# EAGLE design PCB (EAGLE 8.3.2)
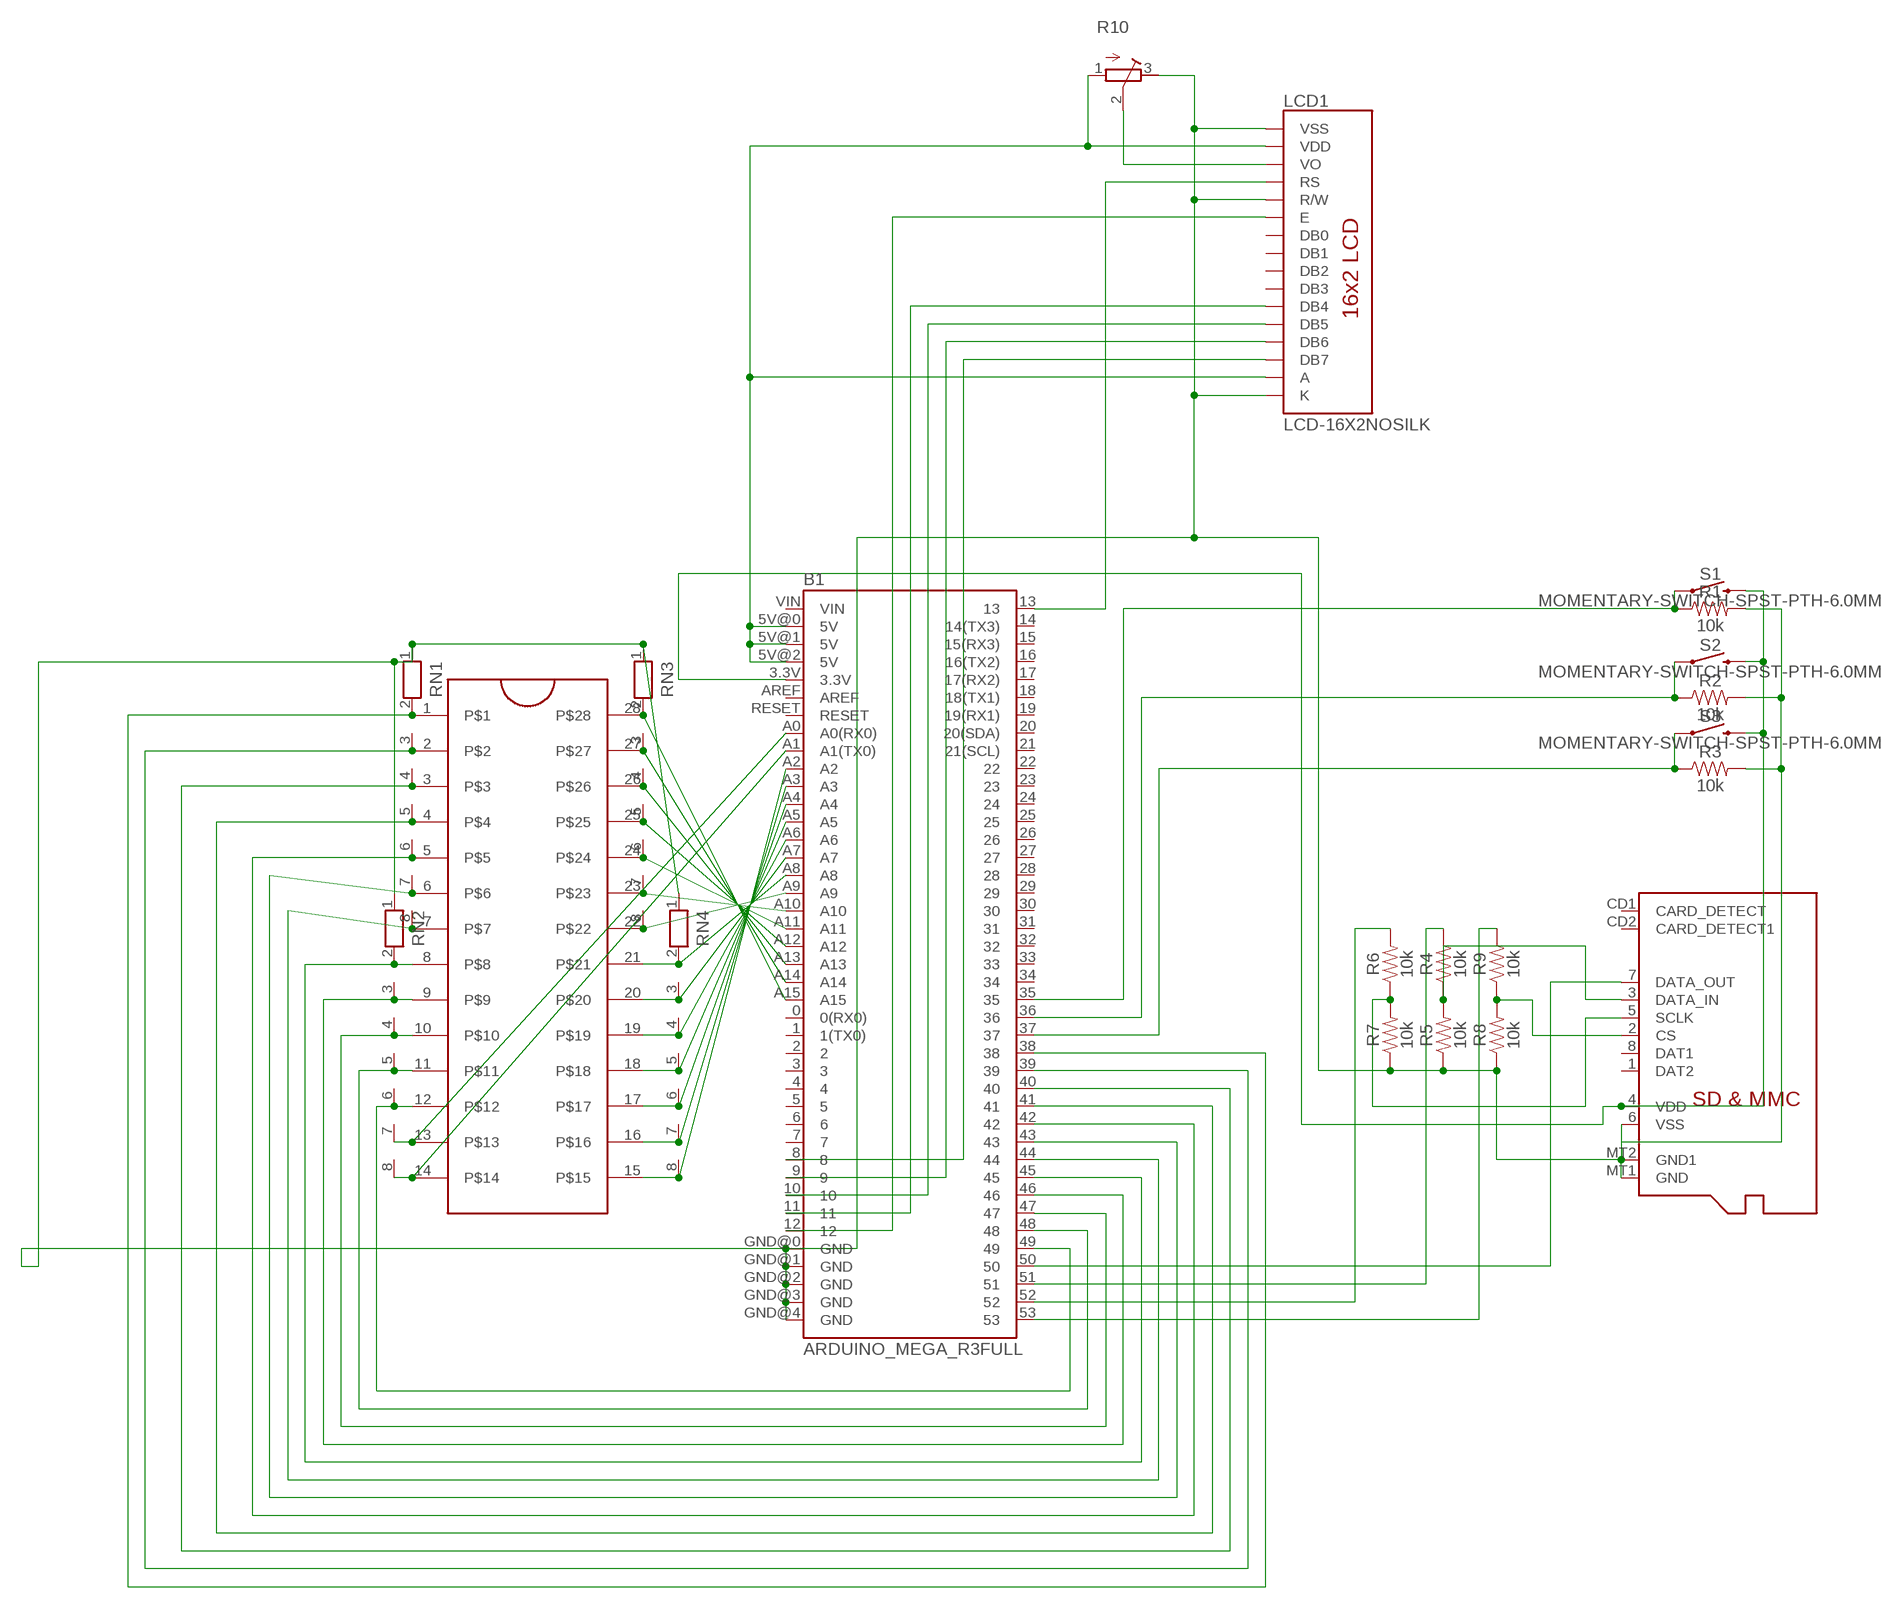
[diagram p0: schematic, sheet 1]

## Parts
B1  ARDUINO_MEGA_R3FULL  [ARDUINO_MEGA]
LCD1  LCD-16X2NOSILK  [LCD-16X2_NOSILK]
R1  10k  10KOHM-HORIZ-1/4W-5%  [AXIAL-0.3]
R2  10k  10KOHM-HORIZ-1/4W-5%  [AXIAL-0.3]
R3  10k  10KOHM-HORIZ-1/4W-5%  [AXIAL-0.3]
R4  10k  10KOHM-HORIZ-1/4W-5%  [AXIAL-0.3]
R5  10k  10KOHM-HORIZ-1/4W-5%  [AXIAL-0.3]
R6  10k  10KOHM-HORIZ-1/4W-5%  [AXIAL-0.3]
R7  10k  10KOHM-HORIZ-1/4W-5%  [AXIAL-0.3]
R8  10k  10KOHM-HORIZ-1/4W-5%  [AXIAL-0.3]
R9  10k  10KOHM-HORIZ-1/4W-5%  [AXIAL-0.3]
R10  R-TRIMM3339P  [RTRIM3339P]
RN1  RN07  [RN-8]
RN2  RN07  [RN-8]
RN3  RN07  [RN-8]
RN4  RN07  [RN-8]
S1  MOMENTARY-SWITCH-SPST-PTH-6.0MM  [TACTILE_SWITCH_PTH_6.0MM]
S2  MOMENTARY-SWITCH-SPST-PTH-6.0MM  [TACTILE_SWITCH_PTH_6.0MM]
S3  MOMENTARY-SWITCH-SPST-PTH-6.0MM  [TACTILE_SWITCH_PTH_6.0MM]
U$1  MICROSD  [MICROSD]
U$2  ZIFSOCKET-28-3ZIFFSOCKET-28-3  [DIL28-3-ZIF_SOCKET]

## Nets
N$1: B1.A15 RN3.2 U$2.28
N$2: B1.A14 RN3.3 U$2.27
N$3: B1.A13 RN3.4 U$2.26
N$4: B1.A12 RN3.5 U$2.25
N$5: B1.A11 RN3.6 U$2.24
N$6: B1.A10 RN3.7 U$2.23
N$7: B1.A9 RN3.8 U$2.22
N$8: B1.A8 RN4.2 U$2.21
N$9: B1.A7 RN4.3 U$2.20
N$10: B1.A6 RN4.4 U$2.19
N$11: B1.A5 RN4.5 U$2.18
N$12: B1.A4 RN4.6 U$2.17
N$13: B1.A3 RN4.7 U$2.16
N$14: B1.A2 RN4.8 U$2.15
N$15: B1.A1(A1(TX0)) RN2.8 U$2.14
N$16: B1.A0(A0(RX0)) RN2.7 U$2.13
N$17: B1.49 RN2.6 U$2.12
N$18: B1.48 RN2.5 U$2.11
N$19: B1.47 RN2.4 U$2.10
N$20: B1.46 RN2.3 U$2.9
N$21: B1.45 RN2.2 U$2.8
N$22: B1.44 RN1.8 U$2.7
N$23: B1.43 RN1.7 U$2.6
N$24: B1.42 RN1.6 U$2.5
N$25: B1.41 RN1.5 U$2.4
N$26: B1.40 RN1.4 U$2.3
N$27: B1.39 RN1.3 U$2.2
N$28: B1.38 RN1.2 U$2.1
N$29: B1.37 R3.P$1 S3.1
N$30: B1.5V@0(5V) B1.5V@1(5V) B1.5V@2(5V) LCD1.2(VDD) LCD1.15(A) R10.1(A)
N$31: R6.P$1 R7.P$2 U$1.5(SCLK)
N$32: R8.P$2 R9.P$1 U$1.2(CS)
N$33: LCD1.3(VO) R10.2(S)
N$34: B1.50 U$1.7(DATA_OUT)
N$35: R4.P$1 R5.P$2 U$1.3(DATA_IN)
N$36: B1.51 R4.P$2
N$37: B1.53 R9.P$2
N$38: B1.52 R6.P$2
N$39: B1.13 LCD1.4(RS)
N$40: B1.12 LCD1.6(E)
N$41: B1.11 LCD1.11(DB4)
N$42: B1.10 LCD1.12(DB5)
N$43: B1.9 LCD1.13(DB6)
N$44: B1.8 LCD1.14(DB7)
N$45: B1.36 R2.P$1 S2.1
N$46: B1.35 R1.P$1 S1.1
VDD: B1.3.3V S1.3 S2.3 S3.3 U$1.4(VDD)
VSS: B1.GND@0(GND) B1.GND@1(GND) B1.GND@2(GND) B1.GND@3(GND) B1.GND@4(GND) LCD1.1(VSS) LCD1.5(R/W) LCD1.16(K) R1.P$2 R2.P$2 R3.P$2 R5.P$1 R7.P$1 R8.P$1 R10.3(E) RN1.1 RN2.1 RN3.1 RN4.1 U$1.6(VSS) U$1.MT1(GND) U$1.MT2(GND1)
Unconnected: B1.0(0(RX0)) B1.1(1(TX0)) B1.2 B1.3 B1.4 B1.5 B1.6 B1.7 B1.14(14(TX3)) B1.15(15(RX3)) B1.16(16(TX2)) B1.17(17(RX2)) B1.18(18(TX1)) B1.19(19(RX1)) B1.20(20(SDA)) B1.21(21(SCL)) B1.22 B1.23 B1.24 B1.25 B1.26 B1.27 B1.28 B1.29 B1.30 B1.31 B1.32 B1.33 B1.34 B1.AREF B1.RESET B1.VIN LCD1.7(DB0) LCD1.8(DB1) LCD1.9(DB2) LCD1.10(DB3) U$1.1(DAT2) U$1.8(DAT1) U$1.CD1(CARD_DETECT) U$1.CD2(CARD_DETECT1)

## Library data of the parts
B1 = SparkFun-Boards:ARDUINO_MEGA_R3: Arduino Mega R3 ATmega2560 R3 compatible footprint. SparkFun Products: Arduino Mega 2560 R3 <https://www.sparkfun.com/products/11061>
LCD1 = SparkFun-Displays:LCD-16X2: Standard text-only 16x2 parallel input LCD Basic 16 character by 2 line display. Typically utilizes the extremely common HD44780 parallel interface chipset SparkFun Products: Basic 16x2 Green <https://www.sparkfun.com/products/255> Basic 8x2 Green <https://www.sparkfun.com/products/11122>; SF_ID: LCD-00255
R1-R9 = SparkFun-Resistors:10KOHM: 10kΩ resistor A resistor is a passive two-terminal electrical component that implements electrical resistance as a circuit element. Resistors act to reduce current flow, and, at the same time, act to lower voltage levels within circuits. - Wikipedia; PROD_ID: RES-09435
R10 = rcl:R-TRIMM: Trimm resistor
RN1-RN4 = resistor-net:RN07: RESISTOR NETWORK; OC_FARNELL: unknown; OC_NEWARK: unknown
S1-S3 = SparkFun-Switches:MOMENTARY-SWITCH-SPST: Momentary Switch (Pushbutton) - SPST Normally-open (NO) SPST momentary switches (buttons, pushbuttons). Variants PTH-12MM - 12mm square, through-hole Momentary Pushbutton Switch - 12mm Square <https://www.sparkfun.com/products/9190> (COM-09190) PTH-6.0MM, PTH-6.0MM-KIT - 6.0mm square, through-hole Mini Pushbutton Switch <https://www.sparkfun.com/products/97> (COM-00097) KIT package intended for soldering kit's - only one side of pads' copper is exposed. PTH-RIGHT-ANGLE-KIT - Right-angle, through-hole Right Angle Tactile Button <https://www.sparkfun.com/products/10791> - Used on SparkFun BigTime Watch Kit <https://www.sparkfun.com/products/11734> SMD-12MM - 12mm square, surface-mount Tactile Button - SMD (12mm) <https://www.sparkfun.com/products/12993> (COM-12993) Used on SparkFun PicoBoard <https://www.sparkfun.com/products/11888> SMD-4.5MM - 4.5mm Square Trackball Switch Used on SparkFun Blackberry Trackballer Breakout <https://www.sparkfun.com/products/13169> SMD-4.6MMX2.8MM - 4.60mm x 2.80mm, surface mount Used on SparkFun SAMD21 Mini Breakout <https://www.sparkfun.com/products/13664> SMD-5.2MM, SMD-5.2-REDUNDANT - 5.2mm square, surface-mount Mini Pushbutton Switch - SMD <https://www.sparkfun.com/products/8720> (COM-08720) Used on Arduino Pro Mini <https://www.sparkfun.com/products/11114> REDUNDANT package connects both switch circuits together SMD-6.0X3.5MM - 6.0 x 3.5mm, surface mount Momentary Reset Switch SMD <https://www.sparkfun.com/products/8229> (COM-08229) SMD-6.2MM-TALL - 6.2mm square, surface mount Tactile Button - SMD (6mm) <https://www.sparkfun.com/products/12992> Used on SparkFun Digital Sandbox <https://www.sparkfun.com/products/12651> SMD-RIGHT-ANGLE - Right-angle, surface mount Used on SparkFun Block for Intel® Edison - Arduino <https://www.sparkfun.com/products/13036>; PROD_ID: SWCH-08441; SF_SKU: COM-00097
U$1 = adafruit:MICROSD: Micro-SD / Transflash card holder with SPI pinout For the 3M # 2908-05WB-MG and/or 4UCON #19656 push-push type
U$2 = SparkFun-Connectors:ZIFSOCKET-28-3: Lever-action ZIF socket for 28-pin ICs

## Board
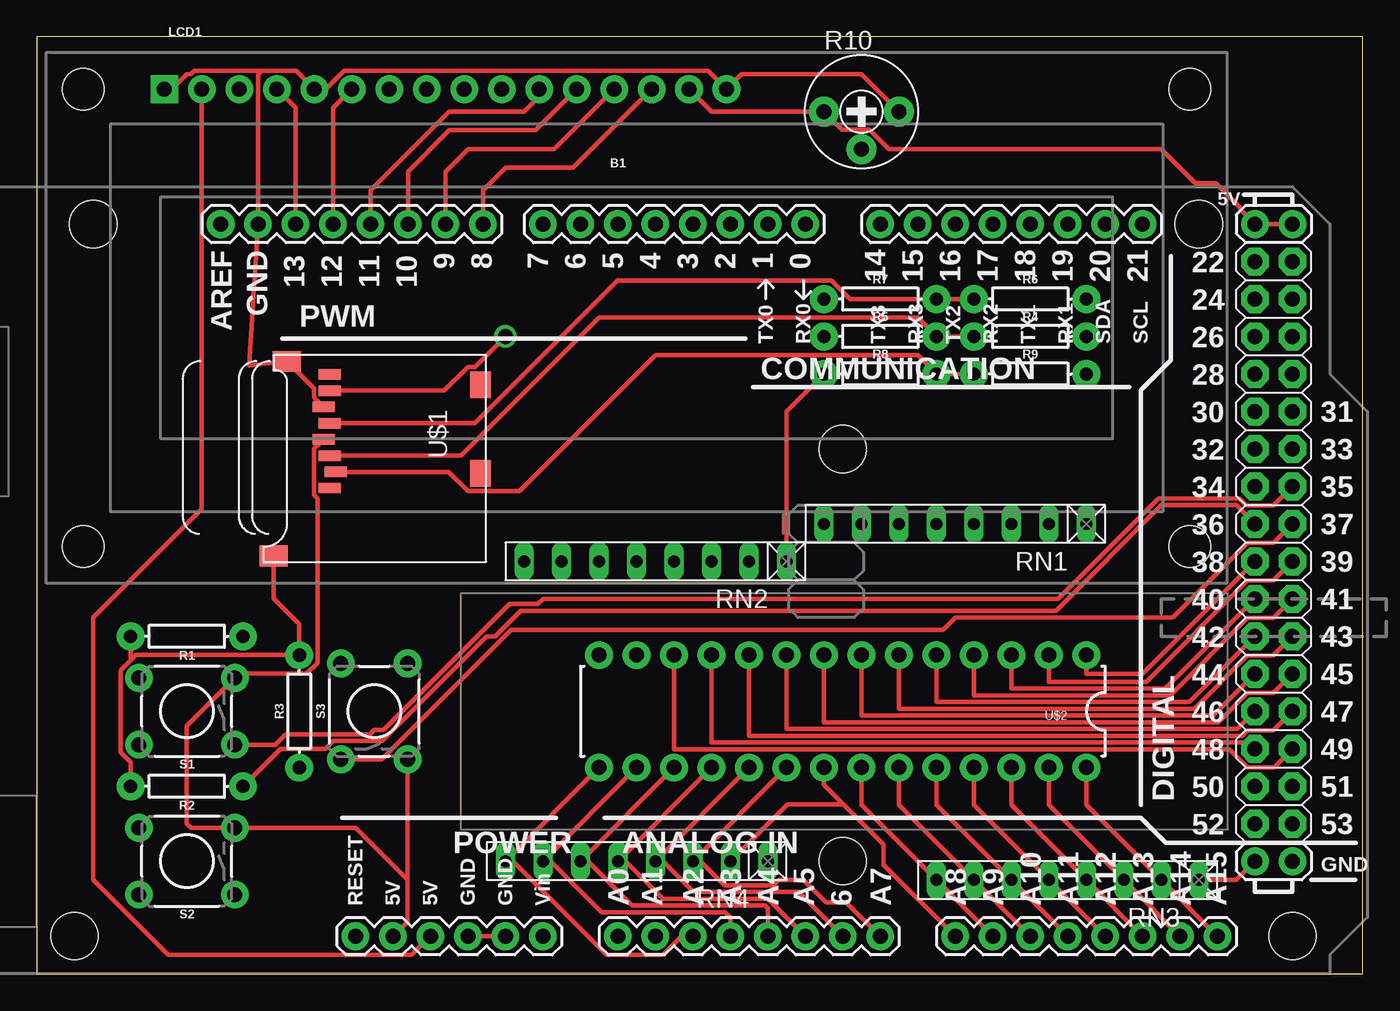
[diagram p1: board, top side]
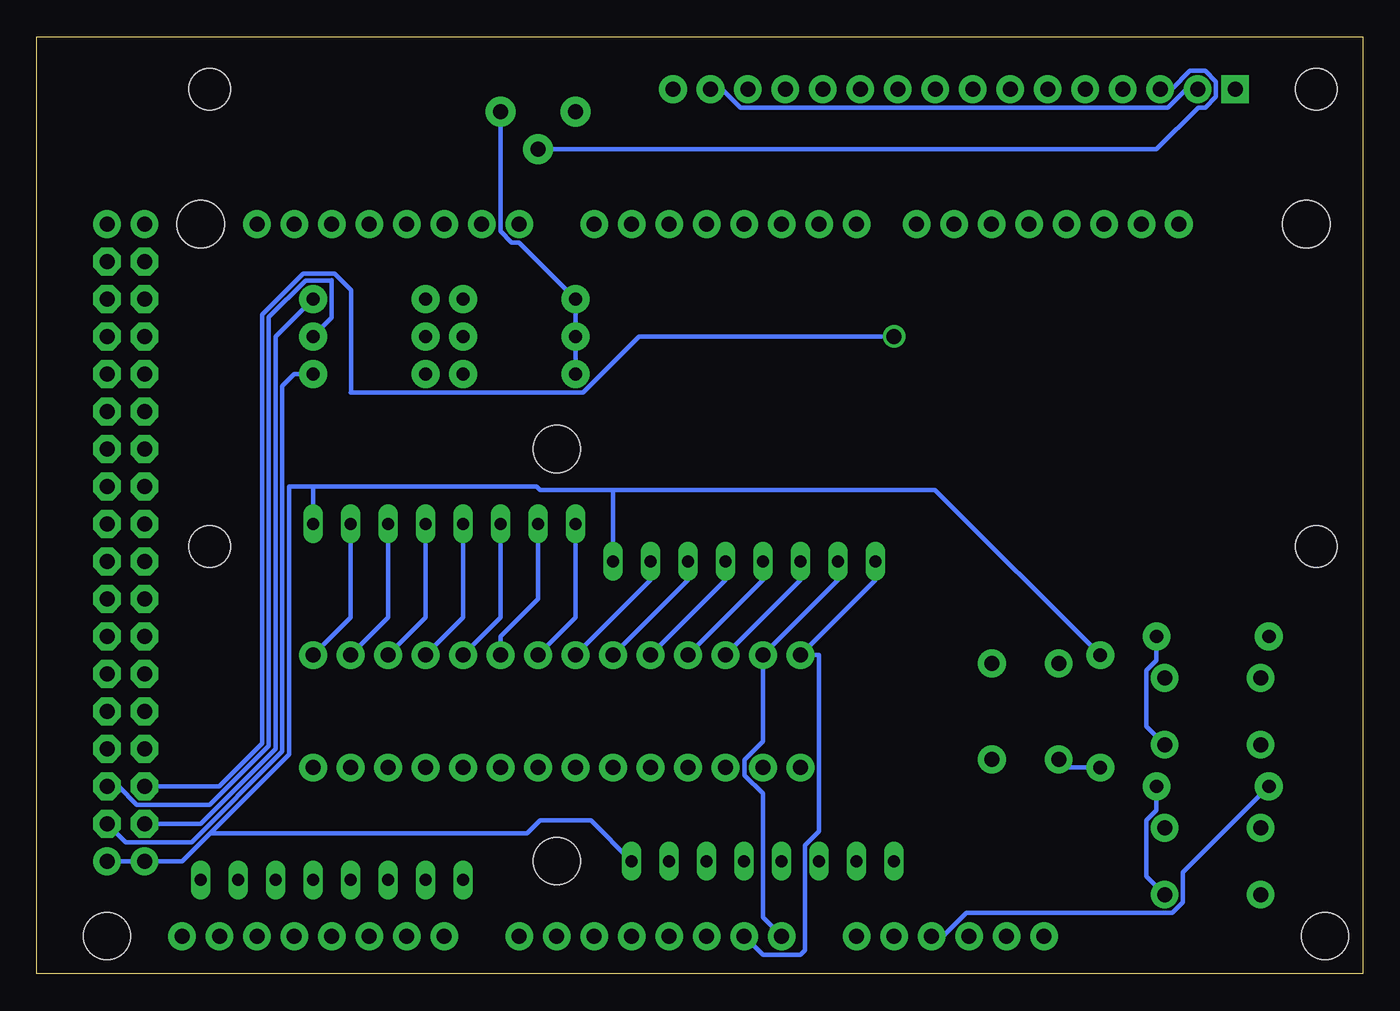
[diagram p2: board, bottom side, seen from below]

Size 89.84 x 63.49 mm. Coordinates in mm from the lower left corner, seen from the top.
Outline: 0,0 89.84,0 89.84,63.49 0,63.49 0,0
Copper layers (1*16): Top 0.035mm / dielectric 1.5mm / Bottom 0.035mm
Design rules "default": minimum track width 6mil, minimum drill 0.35mm, track to track 6mil, track to pad 6mil, pad to pad 6mil, via to via 6mil, smd to smd 6mil, copper to edge 40mil, drill to drill 6mil, minimum pad ring 10mil, minimum via ring 8mil, stop-mask expansion 4mil, vias tented up to drill 0mil, thermal gap 10mil

### Footprints (pad centres in the part's own frame; a part is rotated, then mirrored left to right if it is on the bottom)
ARDUINO_MEGA = drill 1.016 pad 1.88: 0 13.97,24.13; 1 11.43,24.13; 2 8.89,24.13; 3 6.35,24.13; 3.3V -13.97,-24.13; 4 3.81,24.13; 5 1.27,24.13; 5V@0 -11.43,-24.13; 5V@1 44.45,24.13; 5V@2 46.99,24.13; 6 -1.27,24.13; 7 -3.81,24.13; 8 -7.874,24.13; 9 -10.414,24.13; 10 -12.954,24.13; 11 -15.494,24.13; 12 -18.034,24.13; 13 -20.574,24.13; 14 19.05,24.13; 15 21.59,24.13; 16 24.13,24.13; 17 26.67,24.13; 18 29.21,24.13; 19 31.75,24.13; 20 34.29,24.13; 21 36.83,24.13; A0 1.27,-24.13; A1 3.81,-24.13; A2 6.35,-24.13; A3 8.89,-24.13; A4 11.43,-24.13; A5 13.97,-24.13; A6 16.51,-24.13; A7 19.05,-24.13; A8 24.13,-24.13; A9 26.67,-24.13; A10 29.21,-24.13; A11 31.75,-24.13; A12 34.29,-24.13; A13 36.83,-24.13; A14 39.37,-24.13; A15 41.91,-24.13; AREF -25.654,24.13; GND@0 -8.89,-24.13; GND@1 -6.35,-24.13; GND@2 44.45,-19.05; GND@3 46.99,-19.05; GND@4 -23.114,24.13; RESET -16.51,-24.13; VIN -3.81,-24.13 | drill 1.016 pad 1.88 octagon: 22 44.45,21.59; 23 46.99,21.59; 24 44.45,19.05; 25 46.99,19.05; 26 44.45,16.51; 27 46.99,16.51; 28 44.45,13.97; 29 46.99,13.97; 30 44.45,11.43; 31 46.99,11.43; 32 44.45,8.89; 33 46.99,8.89; 34 44.45,6.35; 35 46.99,6.35; 36 44.45,3.81; 37 46.99,3.81; 38 44.45,1.27; 39 46.99,1.27; 40 44.45,-1.27; 41 46.99,-1.27; 42 44.45,-3.81; 43 46.99,-3.81; 44 44.45,-6.35; 45 46.99,-6.35; 46 44.45,-8.89; 47 46.99,-8.89; 48 44.45,-11.43; 49 46.99,-11.43; 50 44.45,-13.97; 51 46.99,-13.97; 52 44.45,-16.51; 53 46.99,-16.51 | hole 3.2: -34.29,24.13; -35.56,-24.13; 16.51,8.89; 16.51,-19.05; 40.64,24.13; 46.99,-24.13
LCD-16X2_NOSILK = drill 1.016 pad 1.88 square: 1 -32,15.5 | drill 1.016 pad 1.88: 2 -29.46,15.5; 3 -26.92,15.5; 4 -24.38,15.5; 5 -21.84,15.5; 6 -19.3,15.5; 7 -16.76,15.5; 8 -14.22,15.5; 9 -11.68,15.5; 10 -9.14,15.5; 11 -6.6,15.5; 12 -4.06,15.5; 13 -1.52,15.5; 14 1.02,15.5; 15 3.56,15.5; 16 6.1,15.5 | hole 2.8: -37.5,15.5; -37.5,-15.5; 37.5,15.5; 37.5,-15.5
AXIAL-0.3 = drill 0.9 pad 1.88: P$1 -3.81,0; P$2 3.81,0
RTRIM3339P = drill 0.61: 1 -2.54,0; 2 0,-2.54; 3 2.54,0
RN-8 = drill 0.813 long: 1 -8.89,0; 2 -6.35,0; 3 -3.81,0; 4 -1.27,0; 5 1.27,0; 6 3.81,0; 7 6.35,0; 8 8.89,0
TACTILE_SWITCH_PTH_6.0MM = drill 1.016 pad 1.88: 1 -3.251,2.261; 2 3.251,2.261; 3 -3.251,-2.261; 4 3.251,-2.261
MICROSD = smd 0.7 x 1.5: 1 9,-10.64; 2 7.9,-10.24; 3 6.8,-10.64; 4 5.7,-11.04; 5 4.6,-10.64; 6 3.5,-11.04; 7 2.4,-10.64; 8 1.3,-10.64 | smd 1.8 x 1.4: CD1 2,-0.44; CD2 8,-0.44 | smd 1.4 x 1.9: MT1 0.4,-13.54; MT2 13.6,-14.44
DIL28-3-ZIF_SOCKET = drill 1.016 pad 1.88: 1 -16.51,-3.81; 2 -13.97,-3.81; 3 -11.43,-3.81; 4 -8.89,-3.81; 5 -6.35,-3.81; 6 -3.81,-3.81; 7 -1.27,-3.81; 8 1.27,-3.81; 9 3.81,-3.81; 10 6.35,-3.81; 11 8.89,-3.81; 12 11.43,-3.81; 13 13.97,-3.81; 14 16.51,-3.81; 15 16.51,3.81; 16 13.97,3.81; 17 11.43,3.81; 18 8.89,3.81; 19 6.35,3.81; 20 3.81,3.81; 21 1.27,3.81; 22 -1.27,3.81; 23 -3.81,3.81; 24 -6.35,3.81; 25 -8.89,3.81; 26 -11.43,3.81; 27 -13.97,3.81; 28 -16.51,3.81

### Placement (x,y rotation side)
B1  38.1,26.67 0 top
LCD1  40.64,44.45 0 top
R1  10.16,22.86 180 top
R2  10.16,12.7 180 top
R3  17.78,17.78 90 top
R4  67.31,43.18 0 top
R5  57.15,43.18 0 top
R6  67.31,45.72 0 top
R7  57.15,45.72 0 top
R8  57.15,40.64 0 top
R9  67.31,40.64 0 top
R10  55.88,58.42 0 top
RN1  62.23,30.48 180 top
RN2  41.91,27.94 180 top
RN3  69.85,6.35 180 top
RN4  40.64,7.62 180 top
S1  10.16,17.78 180 top
S2  10.16,7.62 180 top
S3  22.86,17.78 90 top
U$1  30.48,41.91 270 top
U$2  54.61,17.78 180 top

### Tracks (layer width: path | path; a pad name or v marks a point on that pad's centre or on a via)
N$1
  Top 0.305: U$2.28 71.12,11.43 RN3.2 B1.A15
N$2
  Top 0.305: U$2.27 68.58,11.43 RN3.3 B1.A14
N$3
  Top 0.305: U$2.26 66.04,11.43 RN3.4 B1.A13
N$4
  Top 0.305: U$2.25 63.5,11.43 RN3.5 B1.A12
N$5
  Top 0.305: U$2.24 60.96,11.43 RN3.6 B1.A11
N$6
  Top 0.305: U$2.23 58.42,11.43 RN3.7 B1.A10
N$7
  Top 0.305: U$2.22 55.88,11.43 RN3.8 B1.A9
N$8
  Top 0.305: U$2.21 53.34,12.8 54.66,11.48 | 54.66,11.48 57.38,8.77 57.38,7.39 B1.A8 | 54.66,11.48 50.85,11.48 RN4.2
N$9
  Top 0.305: B1.A7 54.84,4.85 53.46,4.85 51.97,6.35 50.28,6.35 49.93,5.99 46.59,5.99 44.97,7.62 RN4.3 U$2.20
N$10
  Top 0.305: B1.A6 51.61,5.54 44.51,5.54 42.42,7.62 RN4.4 U$2.19
N$11
  Top 0.305: B1.A5 49.53,5.08 42.42,5.08 39.88,7.62 RN4.5 U$2.18
N$12
  Top 0.305: B1.A4 49.53,4.43 49.34,4.62 40.34,4.62 37.34,7.62 RN4.6 U$2.17
N$13
  Top 0.305: B1.A3 46.99,3.81 46.63,4.17 38.26,4.17 34.8,7.62 RN4.7 U$2.16
N$14
  Top 0.305: B1.A2 43.67,2.54 42.43,1.29 38.59,1.29 32.27,7.62 RN4.8 U$2.15
N$15
  Bottom 0.305: RN2.8 33.02,26.67 U$2.14 36.83,21.59 36.83,9.64 37.8,8.68 37.8,1.57 38.1,1.27 40.64,1.27 B1.A1
N$16
  Bottom 0.305: RN2.7 35.56,26.67 U$2.13 40.64,15.73 41.88,14.49 41.88,13.45 40.64,12.21 40.64,3.81 B1.A0
N$17
  Top 0.305: U$2.12 43.18,15.21 80.81,15.21 82.03,13.99 83.84,13.99 B1.49
  Bottom 0.305: RN2.6 38.1,26.67 U$2.12
N$18
  Top 0.305: U$2.11 45.72,15.67 82.12,15.67 B1.48
  Bottom 0.305: RN2.5 40.64,26.67 U$2.11
N$19
  Top 0.305: U$2.10 48.26,16.13 81.68,16.13 82.03,16.48 83.8,16.48 B1.47
  Bottom 0.305: RN2.4 43.18,26.67 U$2.10
N$20
  Top 0.305: U$2.9 50.8,16.59 81.36,16.59 B1.46
  Bottom 0.305: RN2.3 45.72,26.67 U$2.9
N$21
  Top 0.305: U$2.8 53.34,17.04 80.05,17.04 82.03,19.02 83.8,19.02 B1.45
  Bottom 0.305: RN2.2 48.26,26.67 U$2.8
N$22
  Top 0.305: U$2.7 55.88,17.5 79.73,17.5 B1.44
  Bottom 0.305: RN1.8 53.34,24.13 U$2.7
N$23
  Top 0.305: U$2.6 58.42,17.96 78.43,17.96 82.03,21.57 83.8,21.57 B1.43
  Bottom 0.305: RN1.7 55.88,25.4 58.42,22.86 U$2.6
N$24
  Top 0.305: U$2.5 60.96,18.41 78.11,18.41 B1.42
  Bottom 0.305: RN1.6 58.42,24.13 U$2.5
N$25
  Top 0.305: U$2.4 63.5,18.87 76.8,18.87 82.03,24.11 83.8,24.11 B1.41
  Bottom 0.305: RN1.5 60.96,24.13 U$2.4
N$26
  Top 0.305: U$2.3 66.04,19.33 76.48,19.33 B1.40
  Bottom 0.305: RN1.4 63.5,24.13 U$2.3
N$27
  Top 0.305: U$2.2 68.58,19.79 75.18,19.79 82.03,26.64 83.8,26.64 B1.39
  Bottom 0.305: RN1.3 66.04,24.13 U$2.2
N$28
  Top 0.305: U$2.1 71.12,20.32 74.93,20.32 B1.38
  Bottom 0.305: RN1.2 68.58,24.13 U$2.1
N$29
  Top 0.305: S3.1 23.36,14.53 32.12,23.29 61.39,23.29 62.23,24.13 76.98,24.13 82.03,29.18 83.8,29.18 B1.37
  Bottom 0.305: R3.P$1 20.04,13.97 S3.1
N$30  (via drill 1.02 pad 2.03)
  Top 0.305: LCD1.15 45.73,58.42 R10.1 54.56,57.2 56.43,57.2 57.75,55.88 76.2,55.88 78.51,53.57 79.89,53.57 81.51,51.95 81.51,51.84 B1.5V@1 B1.5V@2 | LCD1.2 11.18,31.5 3.81,24.13 3.81,6.35 8.89,1.27 25.4,1.27 B1.5V@0
  Bottom 0.305: LCD1.2 11.96,59.95 13.2,58.7 42.18,58.7 43.42,59.95 LCD1.15
  other vias: 53.34,58.42
N$31
  Top 0.305: R6.P$1 R7.P$2 55.1,45.72 53.86,46.97 39.4,46.97 39.37,46.99 29.69,37.31 U$1.5
N$32
  Top 0.305: R9.P$1 R8.P$2 59.69,41.91 41.91,41.91 34.29,34.29 | 34.29,34.29 34.01,34.01 | 34.29,34.29 34.01,34.01 | U$1.2 27.91,34.01 29.21,32.7 32.7,32.7 34.01,34.01
N$33  (via drill 1.02 pad 2.03)
  Bottom 0.305: R10.2 13.97,55.88 11.14,58.7 10.66,58.7 9.94,59.43 9.94,60.47 10.66,61.2 11.7,61.2 12.94,59.95 LCD1.3
  other vias: 55.88,55.88
N$34  (via drill 1.02 pad 0.51)
  Top 0.305: v31.75,43.18 29.68,41.12 29.21,41.12 27.61,39.51 U$1.7
  Bottom 0.305: B1.50 77.49,12.7 74.57,15.62 74.57,44.67 71.8,47.45 69.66,47.45 68.56,46.34 68.56,39.4 | v31.75,43.18 49.04,43.18 52.82,39.4 68.56,39.4 | 68.58,39.37 68.56,39.4
N$35
  Top 0.305: R4.P$1 R5.P$2 59.69,44.45 38.1,44.45 28.76,35.11 U$1.3
N$36
  Bottom 0.305: B1.51 84.31,12.7 83.07,11.46 81.31,11.46 81.28,11.43 78.12,11.43 74.12,15.43 74.12,44.48 71.64,46.97 69.88,46.97 69.85,46.99 69.85,44.45 R4.P$2
N$37
  Bottom 0.305: R9.P$2 72.39,40.64 73.2,39.83 73.2,15.05 79.34,8.91 83.8,8.91 83.82,8.89 B1.53
N$38
  Bottom 0.305: R6.P$2 73.66,43.18 73.66,15.24 78.74,10.16 B1.52
N$39
  Top 0.305: B1.13 17.53,58.68 LCD1.4
N$40
  Top 0.305: B1.12 20.07,58.68 LCD1.6
N$41
  Top 0.305: B1.11 22.61,53.09 27.94,58.42 33.02,58.42 34.29,59.69 34.29,59.7 LCD1.11
N$42
  Top 0.305: B1.10 25.15,54.36 27.94,57.15 33.78,57.15 LCD1.12
N$43
  Top 0.305: B1.9 27.69,54.36 29.21,55.88 35.05,55.88 LCD1.13
N$44
  Top 0.305: B1.8 30.23,53.09 31.75,54.61 36.32,54.61 LCD1.14
N$45
  Top 0.305: R2.P$1 16.51,15.24 19.55,15.24 20.08,15.77 23.39,15.77 30.48,22.86 31.05,22.86 32.77,24.59 69.04,24.59 76.2,31.75 81.28,31.75 B1.36
  Bottom 0.305: R2.P$1 13.97,11.08 14.66,10.4 14.66,6.6 S2.1
N$46
  Top 0.305: S1.1 16.14,15.52 16.85,16.23 22.58,16.23 22.86,16.51 23.48,16.51 32.02,25.04 33.93,25.04 34.29,25.4 69.2,25.4 76.01,32.21 81.47,32.21 81.95,31.73 83.8,31.73 B1.35
  Bottom 0.305: R1.P$1 13.97,21.24 14.66,20.56 14.66,16.76 S1.1
VDD
  Top 0.305: 25.12,6.35 S3.3 | 25.12,6.35 25.12,3.53 B1.3.3V | 25.12,6.35 21.59,9.88 S2.3 10.44,9.88 10.16,10.16 10.16,16.79 S1.3 13.72,20.34 18.3,20.34 19.02,21.07 19.02,22.86 | 19.02,22.86 | 19.02,22.86 19.02,32.19 18.79,32.43 18.79,35.59 18.96,35.77 19,35.77 U$1.4
VSS  (via drill 1.02 pad 2.03)
  Top 0.305: LCD1.1 9.15,59.95 10.16,60.96 10.43,60.96 10.66,61.2 15.24,61.2 | 15.24,61.2 17.55,61.2 LCD1.5 19.58,59.95 20.82,61.2 45.49,61.2 LCD1.16 47.75,60.96 55.88,60.96 R10.3 | 15.24,61.2 14.99,60.94 B1.GND@4 14.4,41.23 U$1.MT1 18.79,39.66 18.79,39.03 18.96,38.85 19,38.85 U$1.6 | B1.GND@1 B1.GND@0 | R2.P$2 6.35,14.32 5.66,15 5.66,20.56 6.35,21.24 | 6.35,21.24 R1.P$2 | 6.35,21.24 6.7,21.59 R3.P$2 17.78,23.7 16.04,25.44 U$1.MT2 | RN2.1 50.8,38.1 R8.P$1 | RN3.1 81.28,6.35 B1.GND@2
  Bottom 0.305: R8.P$1 R5.P$1 R7.P$1 57.17,49.55 57.67,49.55 58.42,50.31 R10.3 | B1.GND@3 B1.GND@2 79.99,7.62 78.09,9.51 | B1.GND@0 28.43,2.54 26.86,4.12 12.9,4.12 12.17,4.84 12.17,6.88 R2.P$2 | 71.12,33.02 72.75,33.02 72.75,14.86 78.09,9.51 | 71.12,33.02 55.98,33.02 55.76,32.79 50.8,32.79 | R3.P$2 28.98,32.79 50.8,32.79 | RN2.1 50.8,32.79 | 71.12,33.02 RN1.1 | 78.09,9.51 56.63,9.51 55.76,10.39 52.3,10.39 RN4.1
  other vias: 58.42,58.42